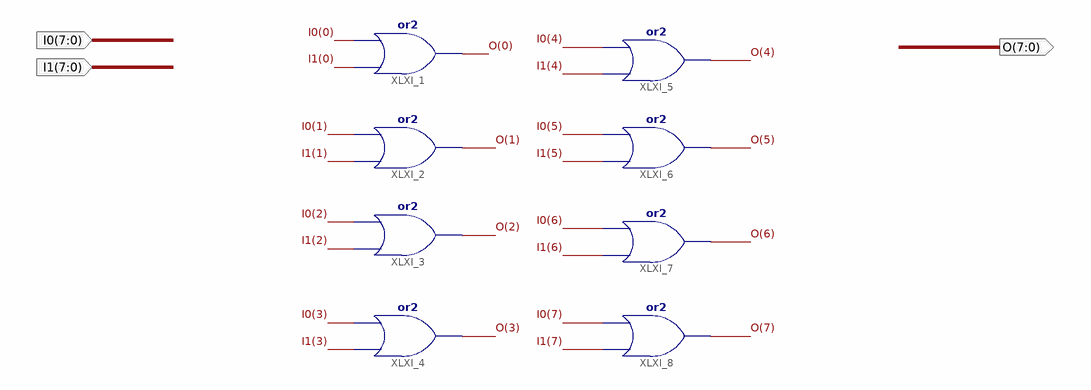
[diagram p0: schematic sheet 1]
// Xilinx ISE schematic or8b2.sch (spartan3e) as structural Verilog: 8 symbols, 3 ports
module or8b2 (
  input  [7:0] I0,
  input  [7:0] I1,
  output [7:0] O
);

  or XLXI_1 (O[0], I1[0], I0[0]);
  or XLXI_2 (O[1], I1[1], I0[1]);
  or XLXI_3 (O[2], I1[2], I0[2]);
  or XLXI_4 (O[3], I1[3], I0[3]);
  or XLXI_5 (O[4], I1[4], I0[4]);
  or XLXI_6 (O[5], I1[5], I0[5]);
  or XLXI_7 (O[6], I1[6], I0[6]);
  or XLXI_8 (O[7], I1[7], I0[7]);
endmodule
